# Altium schematic sheet Motor.SchDoc
size A4
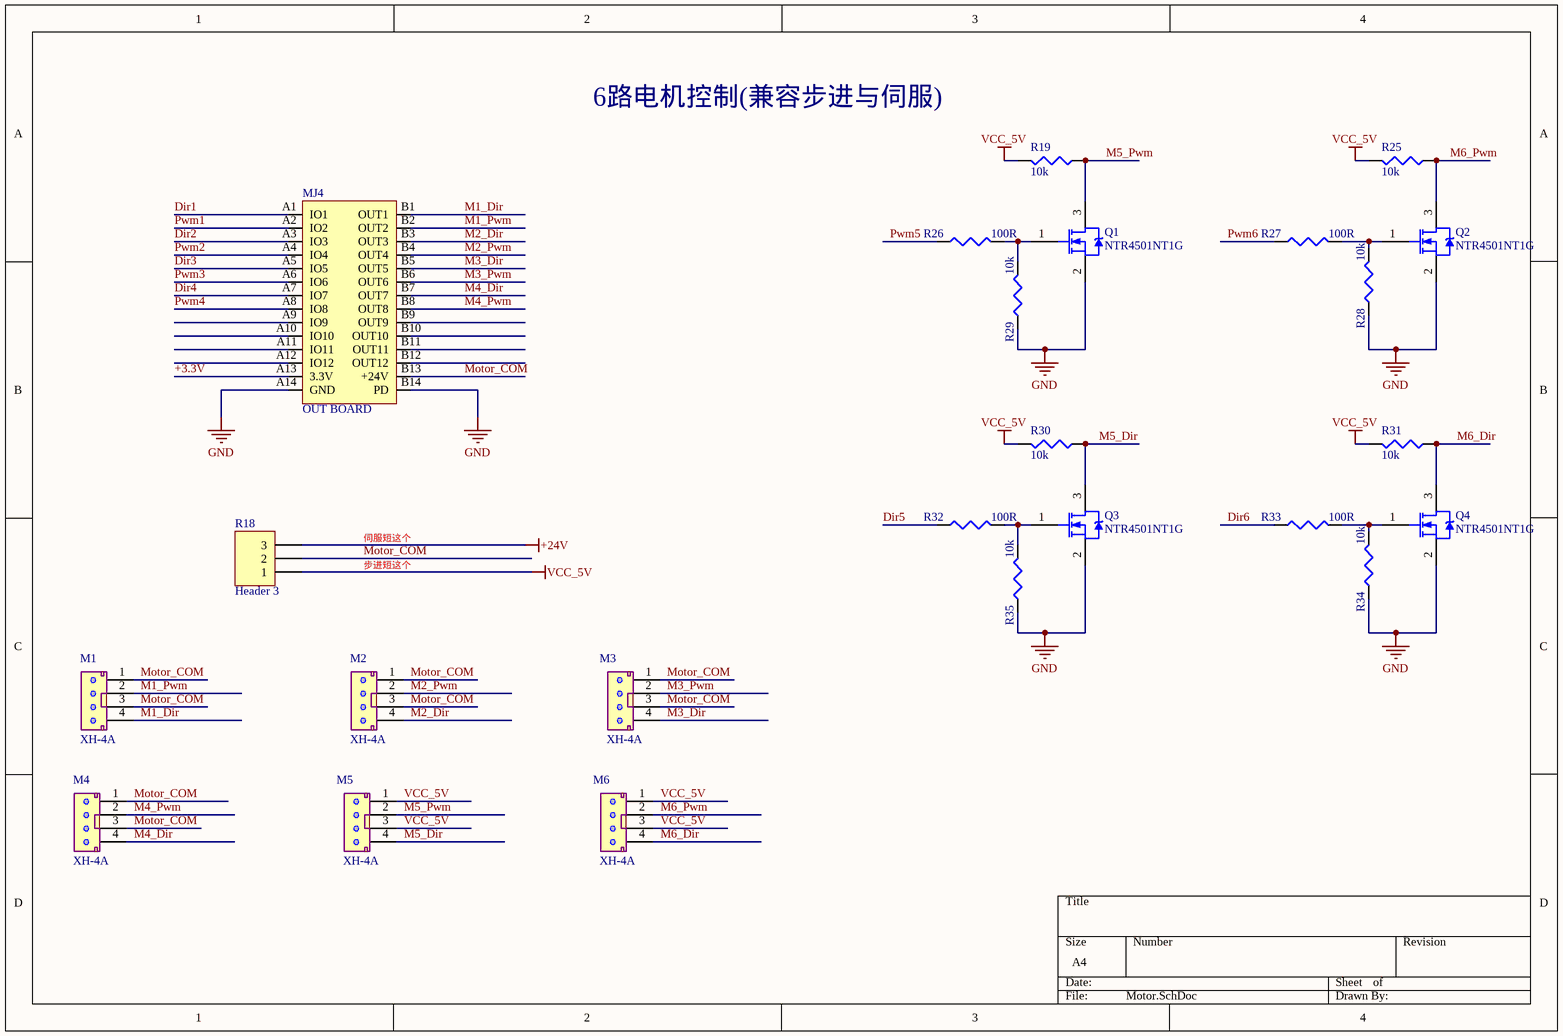
[diagram p0: Motor.SchDoc]

## Parts
M1  XH-4A  [CN4-3.5]
M2  XH-4A  [CN4-3.5]
M3  XH-4A  [CN4-3.5]
M4  XH-4A  [CN4-3.5]
M5  XH-4A  [CN4-3.5]
M6  XH-4A  [CN4-3.5]
MJ4  OUT BOARD  [OUT BOARD]
Q1  NTR4501NT1G  [SOT-23]
Q2  NTR4501NT1G  [SOT-23]
Q3  NTR4501NT1G  [SOT-23]
Q4  NTR4501NT1G  [SOT-23]
R18  Header 3  [3P-0603]
R19  10k  [0603R]
R25  10k  [0603R]
R26  100R  [0603R]
R27  100R  [0603R]
R28  10k  [0603R]
R29  10k  [0603R]
R30  10k  [0603R]
R31  10k  [0603R]
R32  100R  [0603R]
R33  100R  [0603R]
R34  10k  [0603R]
R35  10k  [0603R]

## Nets
+24V: R18.3
GND: MJ4.A14(GND) MJ4.B14(PD) Q1.2(S) Q2.2(S) Q3.2(S) Q4.2(S) R28.1 R29.1 R34.1 R35.1
VCC_5V: M5.1 M5.3 M6.1 M6.3 R18.1 R19.2 R25.2 R30.2 R31.2
+3.3V: MJ4.A13(3.3V)
Dir1: MJ4.A1(IO1)
Dir2: MJ4.A3(IO3)
Dir3: MJ4.A5(IO5)
Dir4: MJ4.A7(IO7)
Dir5: R32.1
Dir6: R33.1
M1_Dir: M1.4 MJ4.B1(OUT1)
M1_Pwm: M1.2 MJ4.B2(OUT2)
M2_Dir: M2.4 MJ4.B3(OUT3)
M2_Pwm: M2.2 MJ4.B4(OUT4)
M3_Dir: M3.4 MJ4.B5(OUT5)
M3_Pwm: M3.2 MJ4.B6(OUT6)
M4_Dir: M4.4 MJ4.B7(OUT7)
M4_Pwm: M4.2 MJ4.B8(OUT8)
M5_Dir: M5.4 Q3.3(D) R30.1
M5_Pwm: M5.2 Q1.3(D) R19.1
M6_Dir: M6.4 Q4.3(D) R31.1
M6_Pwm: M6.2 Q2.3(D) R25.1
Motor_COM: M1.1 M1.3 M2.1 M2.3 M3.1 M3.3 M4.1 M4.3 MJ4.B13(+24V) R18.2
Pwm1: MJ4.A2(IO2)
Pwm2: MJ4.A4(IO4)
Pwm3: MJ4.A6(IO6)
Pwm4: MJ4.A8(IO8)
Pwm5: R26.1
Pwm6: R27.1
NetQ1_1: Q1.1(G) R26.2 R29.2
NetQ2_1: Q2.1(G) R27.2 R28.2
NetQ3_1: Q3.1(G) R32.2 R35.2
NetQ4_1: Q4.1(G) R33.2 R34.2

Not connected (* = marked no-connect by the designer): MJ4 A9(IO9) A10(IO10) A11(IO11) A12(IO12) B9(OUT9) B10(OUT10) B11(OUT11) B12(OUT12)

## Notes on the sheet
- 6路电机控制(兼容步进与伺服)
- 伺服短这个
- 步进短这个

## Library data of the parts
M1-M6 = CON4
MJ4 = J-OUTPUT
Q1-Q4 = MOSFET-N: MOSFET N沟道
R18 = Header 3: Header, 3-Pin; LatestRevisionDate: 17-Jul-2002; LatestRevisionNote: Re-released for DXP Platform.; Publisher: Altium Limited
R19 R25-R35 = RES1